# Altium schematic sheet SHDN-S02-V00-ShutdownSegments.SchDoc: Shutdown Segments
size A3; DrawnBy: Jonn Dillon; DocumentNumber: 2; SheetNumber: 2; SheetTotal: 11; Project: Shutdown Board 2020
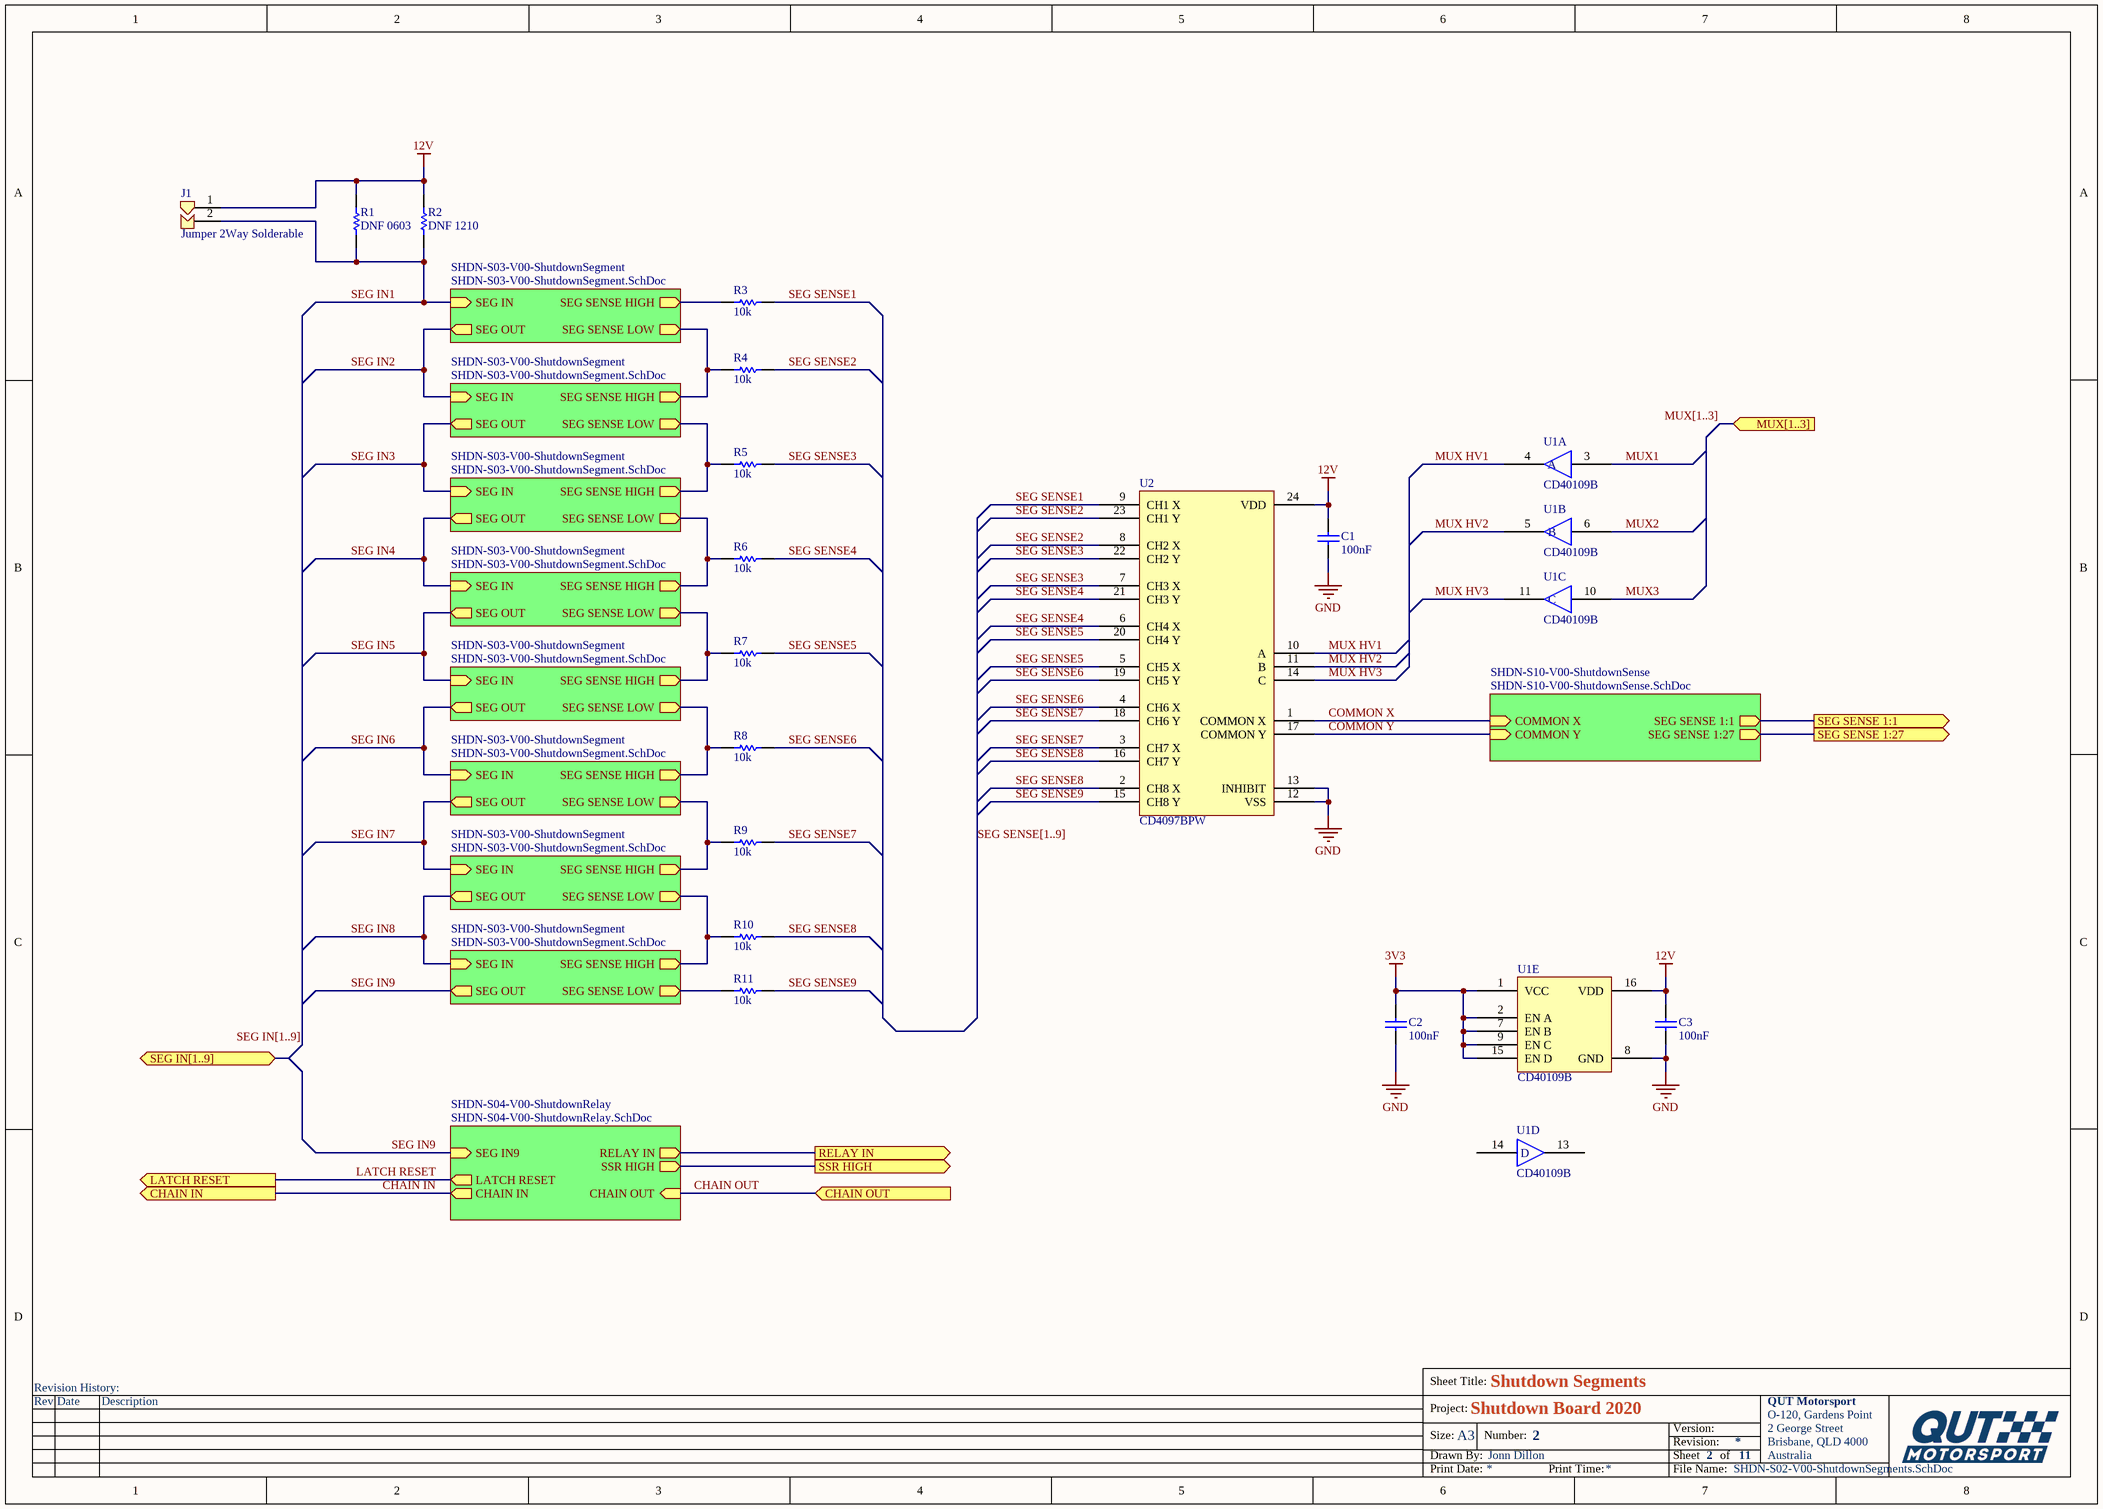
[diagram p0: SHDN-S02-V00-ShutdownSegments.SchDoc]

## Parts
C1  100nF  [Cap_Ceramic_0603]
C2  100nF  [Cap_Ceramic_0603]
C3  100nF  [Cap_Ceramic_0603]
J1  Jumper 2Way Solderable  [Jumper_2Way_Solderable]
R1  DNF 0603  [Res_ThinFilm_0603]
R2  DNF 1210  [Res_ThinFilm_1210]
R3  10k  [Res_ThinFilm_0603]
R4  10k  [Res_ThinFilm_0603]
R5  10k  [Res_ThinFilm_0603]
R6  10k  [Res_ThinFilm_0603]
R7  10k  [Res_ThinFilm_0603]
R8  10k  [Res_ThinFilm_0603]
R9  10k  [Res_ThinFilm_0603]
R10  10k  [Res_ThinFilm_0603]
R11  10k  [Res_ThinFilm_0603]
U1  CD40109B  [TSSOP-16]  (parts A,B,C,D,E of 5)
U2  CD4097BPW  [TSSOP-24]

## Sub-sheets
SHDN-S03-V00-ShutdownSegment = SHDN-S03-V00-ShutdownSegment.SchDoc: SEG OUT (out), SEG IN (in), SEG SENSE HIGH (out), SEG SENSE LOW (out)
SHDN-S03-V00-ShutdownSegment = SHDN-S03-V00-ShutdownSegment.SchDoc: SEG OUT (out), SEG IN (in), SEG SENSE HIGH (out), SEG SENSE LOW (out)
SHDN-S03-V00-ShutdownSegment = SHDN-S03-V00-ShutdownSegment.SchDoc: SEG OUT (out), SEG IN (in), SEG SENSE HIGH (out), SEG SENSE LOW (out)
SHDN-S03-V00-ShutdownSegment = SHDN-S03-V00-ShutdownSegment.SchDoc: SEG OUT (out), SEG IN (in), SEG SENSE HIGH (out), SEG SENSE LOW (out)
SHDN-S03-V00-ShutdownSegment = SHDN-S03-V00-ShutdownSegment.SchDoc: SEG OUT (out), SEG IN (in), SEG SENSE HIGH (out), SEG SENSE LOW (out)
SHDN-S03-V00-ShutdownSegment = SHDN-S03-V00-ShutdownSegment.SchDoc: SEG OUT (out), SEG IN (in), SEG SENSE HIGH (out), SEG SENSE LOW (out)
SHDN-S03-V00-ShutdownSegment = SHDN-S03-V00-ShutdownSegment.SchDoc: SEG OUT (out), SEG IN (in), SEG SENSE HIGH (out), SEG SENSE LOW (out)
SHDN-S03-V00-ShutdownSegment = SHDN-S03-V00-ShutdownSegment.SchDoc: SEG OUT (out), SEG IN (in), SEG SENSE HIGH (out), SEG SENSE LOW (out)
SHDN-S04-V00-ShutdownRelay = SHDN-S04-V00-ShutdownRelay.SchDoc: CHAIN OUT (in), CHAIN IN (out), LATCH RESET (out), SEG IN9 (in), RELAY IN (out), SSR HIGH (out)
SHDN-S10-V00-ShutdownSense = SHDN-S10-V00-ShutdownSense.SchDoc: COMMON X (in), COMMON Y (in), SEG SENSE 1:27 (out), SEG SENSE 1:1 (out)

## Ports
CHAIN IN (out), CHAIN OUT (in), LATCH RESET (out), MUX[1..3] (in), RELAY IN (out), SEG IN[1..9] (bidir), SEG SENSE 1:1 (out), SEG SENSE 1:27 (out), SSR HIGH (out)

## Nets
3V3: C2.2 U1.1(VCC) U1.2(EN_A) U1.7(EN_B) U1.9(EN_C) U1.15(EN_D)
12V: C1.2 C3.2 J1.1 R1.2 R2.2 U1.16(VDD) U2.24(VDD)
GND: C1.1 C2.1 C3.1 U1.8(GND) U2.12(VSS) U2.13(INHIBIT)
CHAIN IN: port CHAIN IN, sheet SHDN-S04-V00-ShutdownRelay/CHAIN IN
CHAIN OUT: port CHAIN OUT, sheet SHDN-S04-V00-ShutdownRelay/CHAIN OUT
COMMON X: U2.1(COMMON_X) ; sheet SHDN-S10-V00-ShutdownSense/COMMON X
COMMON Y: U2.17(COMMON_Y) ; sheet SHDN-S10-V00-ShutdownSense/COMMON Y
LATCH RESET: port LATCH RESET, sheet SHDN-S04-V00-ShutdownRelay/LATCH RESET
MUX1: U1.3(A)
MUX2: U1.6(B)
MUX3: U1.10(C)
MUX HV1: U1.4(E) U2.10(A)
MUX HV2: U1.5(F) U2.11(B)
MUX HV3: U1.11(G) U2.14(C)
RELAY IN: port RELAY IN, sheet SHDN-S04-V00-ShutdownRelay/RELAY IN
SEG IN1: J1.2 R1.1 R2.1 ; sheet SHDN-S03-V00-ShutdownSegment/SEG IN
SEG IN2: sheet SHDN-S03-V00-ShutdownSegment/SEG OUT, sheet SHDN-S03-V00-ShutdownSegment/SEG IN
SEG IN3: sheet SHDN-S03-V00-ShutdownSegment/SEG OUT, sheet SHDN-S03-V00-ShutdownSegment/SEG IN
SEG IN4: sheet SHDN-S03-V00-ShutdownSegment/SEG OUT, sheet SHDN-S03-V00-ShutdownSegment/SEG IN
SEG IN5: sheet SHDN-S03-V00-ShutdownSegment/SEG OUT, sheet SHDN-S03-V00-ShutdownSegment/SEG IN
SEG IN6: sheet SHDN-S03-V00-ShutdownSegment/SEG OUT, sheet SHDN-S03-V00-ShutdownSegment/SEG IN
SEG IN7: sheet SHDN-S03-V00-ShutdownSegment/SEG OUT, sheet SHDN-S03-V00-ShutdownSegment/SEG IN
SEG IN8: sheet SHDN-S03-V00-ShutdownSegment/SEG OUT, sheet SHDN-S03-V00-ShutdownSegment/SEG IN
SEG IN9: sheet SHDN-S04-V00-ShutdownRelay/SEG IN9, sheet SHDN-S03-V00-ShutdownSegment/SEG OUT
SEG SENSE1: R3.2 U2.9(CH1_X)
SEG SENSE2: R4.2 U2.8(CH2_X) U2.23(CH1_Y)
SEG SENSE3: R5.2 U2.7(CH3_X) U2.22(CH2_Y)
SEG SENSE4: R6.2 U2.6(CH4_X) U2.21(CH3_Y)
SEG SENSE5: R7.2 U2.5(CH5_X) U2.20(CH4_Y)
SEG SENSE6: R8.2 U2.4(CH6_X) U2.19(CH5_Y)
SEG SENSE7: R9.2 U2.3(CH7_X) U2.18(CH6_Y)
SEG SENSE8: R10.2 U2.2(CH8_X) U2.16(CH7_Y)
SEG SENSE9: R11.2 U2.15(CH8_Y)
SEG SENSE 1:1: port SEG SENSE 1:1, sheet SHDN-S10-V00-ShutdownSense/SEG SENSE 1:1
SEG SENSE 1:27: port SEG SENSE 1:27, sheet SHDN-S10-V00-ShutdownSense/SEG SENSE 1:27
SSR HIGH: port SSR HIGH, sheet SHDN-S04-V00-ShutdownRelay/SSR HIGH
NetR3_1: R3.1 ; sheet SHDN-S03-V00-ShutdownSegment/SEG SENSE HIGH
NetR4_1: R4.1 ; sheet SHDN-S03-V00-ShutdownSegment/SEG SENSE LOW, sheet SHDN-S03-V00-ShutdownSegment/SEG SENSE HIGH
NetR5_1: R5.1 ; sheet SHDN-S03-V00-ShutdownSegment/SEG SENSE LOW, sheet SHDN-S03-V00-ShutdownSegment/SEG SENSE HIGH
NetR6_1: R6.1 ; sheet SHDN-S03-V00-ShutdownSegment/SEG SENSE LOW, sheet SHDN-S03-V00-ShutdownSegment/SEG SENSE HIGH
NetR7_1: R7.1 ; sheet SHDN-S03-V00-ShutdownSegment/SEG SENSE LOW, sheet SHDN-S03-V00-ShutdownSegment/SEG SENSE HIGH
NetR8_1: R8.1 ; sheet SHDN-S03-V00-ShutdownSegment/SEG SENSE LOW, sheet SHDN-S03-V00-ShutdownSegment/SEG SENSE HIGH
NetR9_1: R9.1 ; sheet SHDN-S03-V00-ShutdownSegment/SEG SENSE LOW, sheet SHDN-S03-V00-ShutdownSegment/SEG SENSE HIGH
NetR10_1: R10.1 ; sheet SHDN-S03-V00-ShutdownSegment/SEG SENSE LOW, sheet SHDN-S03-V00-ShutdownSegment/SEG SENSE HIGH
NetR11_1: R11.1 ; sheet SHDN-S03-V00-ShutdownSegment/SEG SENSE LOW

Not connected (* = marked no-connect by the designer): U1 13(H) 14(D)

## Buses and harness runs
bus MUX[1..3] = port MUX[1..3]
bus SEG IN[1..9] = port SEG IN[1..9]
bus SEG SENSE[1..9]

## Notes on the sheet
- Revision History:
- Sheet Title:
- Rev
- Date
- Description
- Project:
- Size:
- Drawn By:
- A3
- Number:
- Revision:
- Sheet
- Version:
- of
- QUT Motorsport
- O-120, Gardens Point
- 2 George Street
- Brisbane, QLD 4000
- Australia
- Print Date:
- Print Time:
- File Name:

## Library data of the parts
C1-C3 = 100nF 50V 5% X7R 0603: Capacitor, Ceramic, SMD, 100nF, 50V, 5%, X7R, 0603
J1 = Jumper 2Way Side Solderable
R1 = DNF 0603: Resistor, SMD, DNF, 0.1W, 0603
R2 = DNF 1210: Resistor, SMD, DNF, 0.1W, 1210
R3-R11 = 10k 5% 0603: Resistor, SMD, 10k, 0.1W, 5%, 0603
U1 = CD40109B: Voltage Level Translator Unidirectional 4 Circuit 1 Channel 16-TSSOP
U2 = CD4097BPW: 2 Circuit IC Switch 8:1 240Ohm, TSSOP-24